# EAGLE design gt-jtx (EAGLE 6.3)
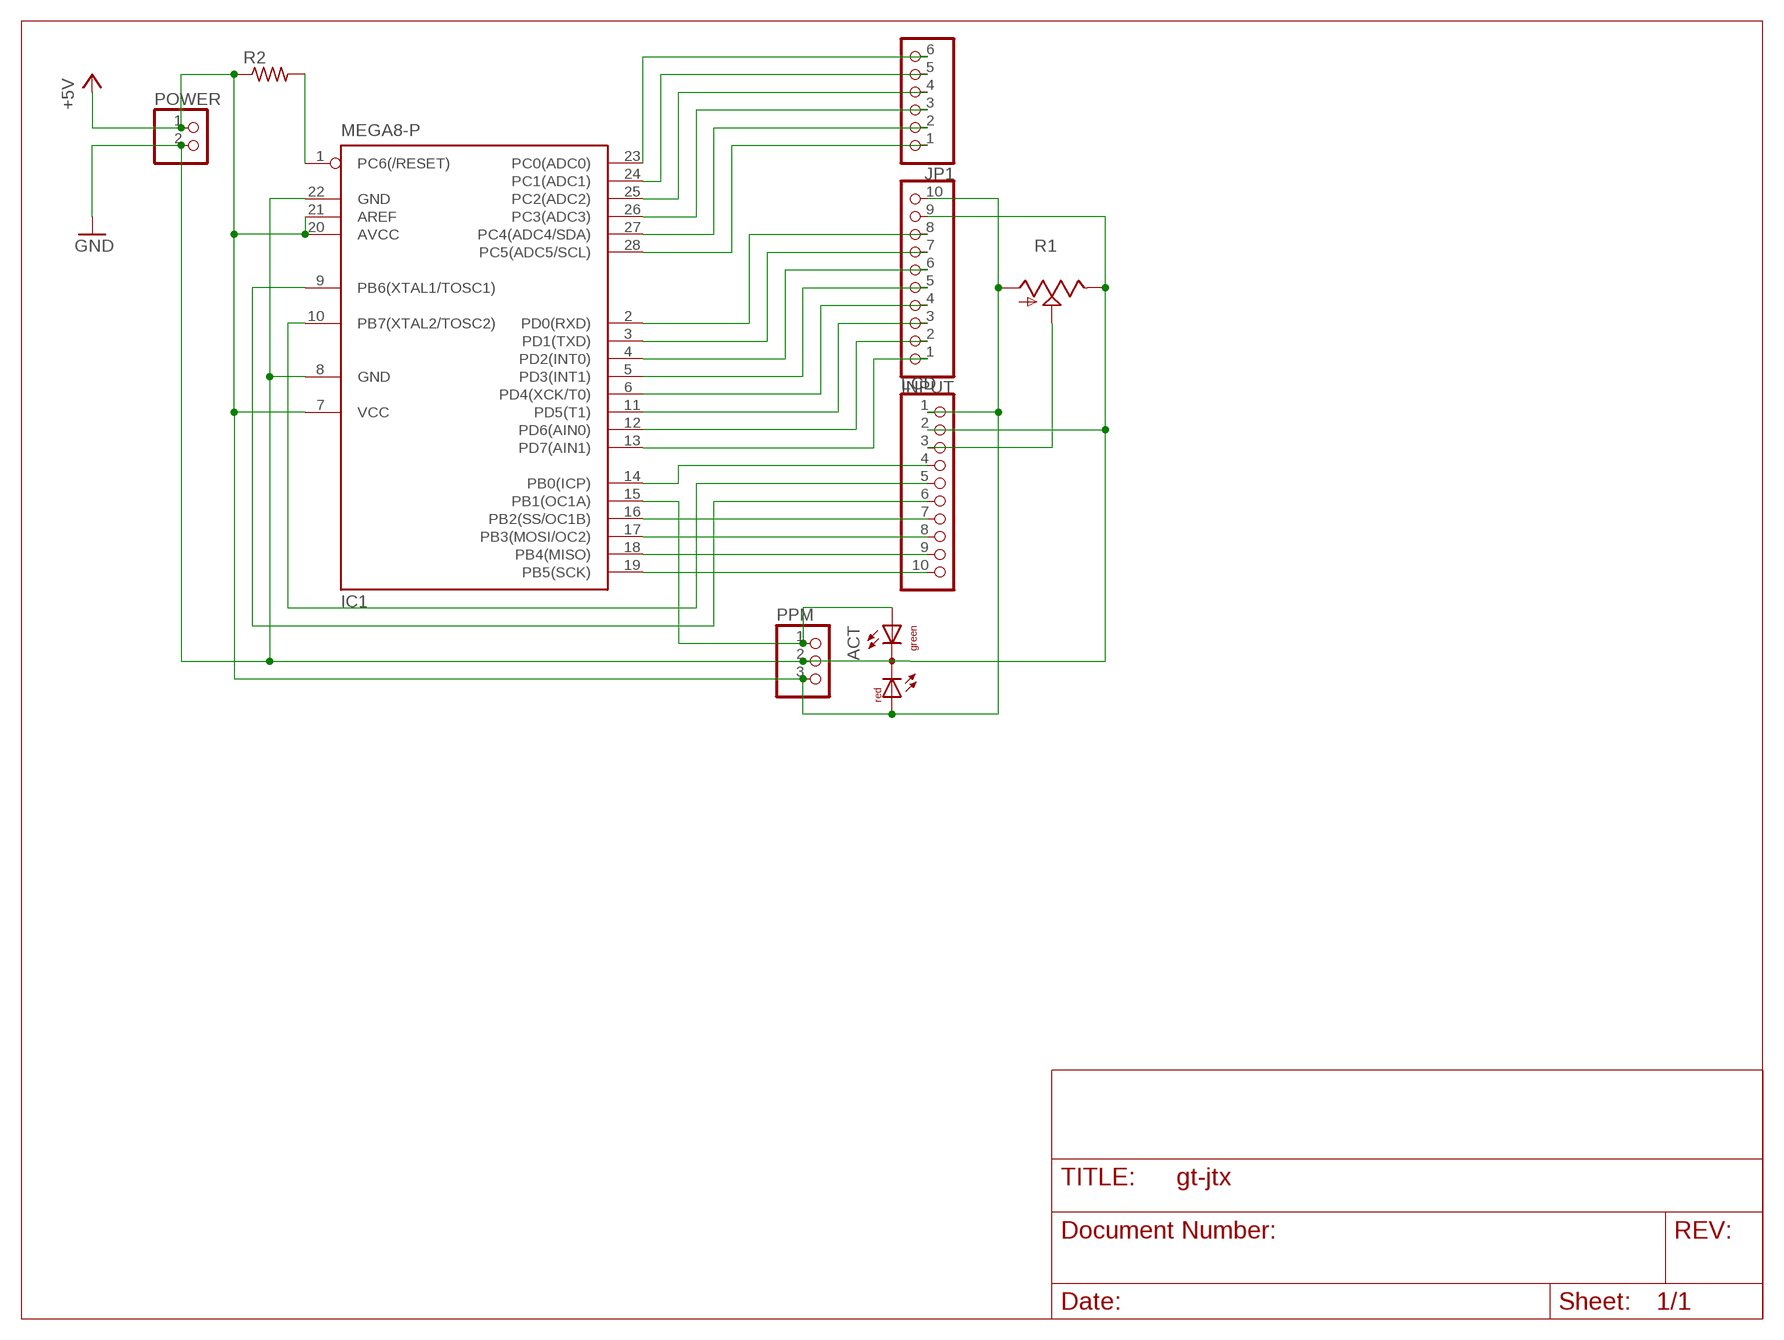
[diagram p0: schematic, sheet 1]

## Parts
ACT  DUOLED-RG-C  [DUOLED-C-5MM]
IC1  MEGA8-P  [DIL28-3]
INPUT  PINHD-1X10  [1X10]
JP1  PINHD-1X6  [1X06]
LCD  PINHD-1X10  [1X10]
POWER  PINHD-1X2  [1X02]
PPM  PINHD-1X3  [1X03]
R1  TRIM_US-CA6V  [CA6V]
R2  R-US_0204/2V  [0204V]

## Nets
+5V: ACT.AR IC1.7(VCC) IC1.20(AVCC) IC1.21(AREF) INPUT.10 LCD.1 POWER.1 PPM.3 R1.A R2.1
GND: ACT.C IC1.8(GND) IC1.22(GND) INPUT.9 LCD.2 POWER.2 PPM.2 R1.E
N$1: IC1.23(PC0(ADC0)) JP1.6
N$2: IC1.24(PC1(ADC1)) JP1.5
N$3: IC1.25(PC2(ADC2)) JP1.4
N$4: IC1.26(PC3(ADC3)) JP1.3
N$5: IC1.14(PB0(ICP)) LCD.4
N$6: IC1.10(PB7(XTAL2/TOSC2)) LCD.5
N$7: IC1.9(PB6(XTAL1/TOSC1)) LCD.6
N$8: IC1.2(PD0(RXD)) INPUT.8
N$9: LCD.3 R1.S
N$10: IC1.27(PC4(ADC4/SDA)) JP1.2
N$11: IC1.28(PC5(ADC5/SCL)) JP1.1
N$12: IC1.19(PB5(SCK)) LCD.10
N$13: IC1.18(PB4(MISO)) LCD.9
N$14: IC1.17(PB3(MOSI/OC2)) LCD.8
N$15: IC1.16(PB2(SS/OC1B)) LCD.7
N$16: ACT.AX(AG) IC1.15(PB1(OC1A)) PPM.1
N$17: IC1.3(PD1(TXD)) INPUT.7
N$18: IC1.4(PD2(INT0)) INPUT.6
N$19: IC1.5(PD3(INT1)) INPUT.5
N$20: IC1.6(PD4(XCK/T0)) INPUT.4
N$21: IC1.11(PD5(T1)) INPUT.3
N$22: IC1.13(PD7(AIN1)) INPUT.1
N$23: IC1.12(PD6(AIN0)) INPUT.2
N$25: IC1.1(PC6(/RESET)) R2.2

## Library data of the parts
ACT = led:DUOLED-RG-C: DUO LED 2 colors (red/green), 5 mm, round, common Cathode www.ligitek.com or other producers.
IC1 = atmel:MEGA8-P: MICROCONTROLLER 8 Kbytes FLASH, 1 kbytes SRAM, 512 bytes EEPROM, USART, 4-channel 10 bit ADC, 2-channel 8 bit ADC Pin compatible with Atmega48, ATMega88, ATMega168 Source: avr.lbr; OC_FARNELL: unknown; OC_NEWARK: unknown
INPUT LCD = pinhead:PINHD-1X10: PIN HEADER
JP1 = pinhead:PINHD-1X6: PIN HEADER
POWER = pinhead:PINHD-1X2: PIN HEADER
PPM = pinhead:PINHD-1X3: PIN HEADER
R1 = pot:TRIM_US-: POTENTIOMETER
R2 = resistor:R-US_: RESISTOR, American symbol

## Board
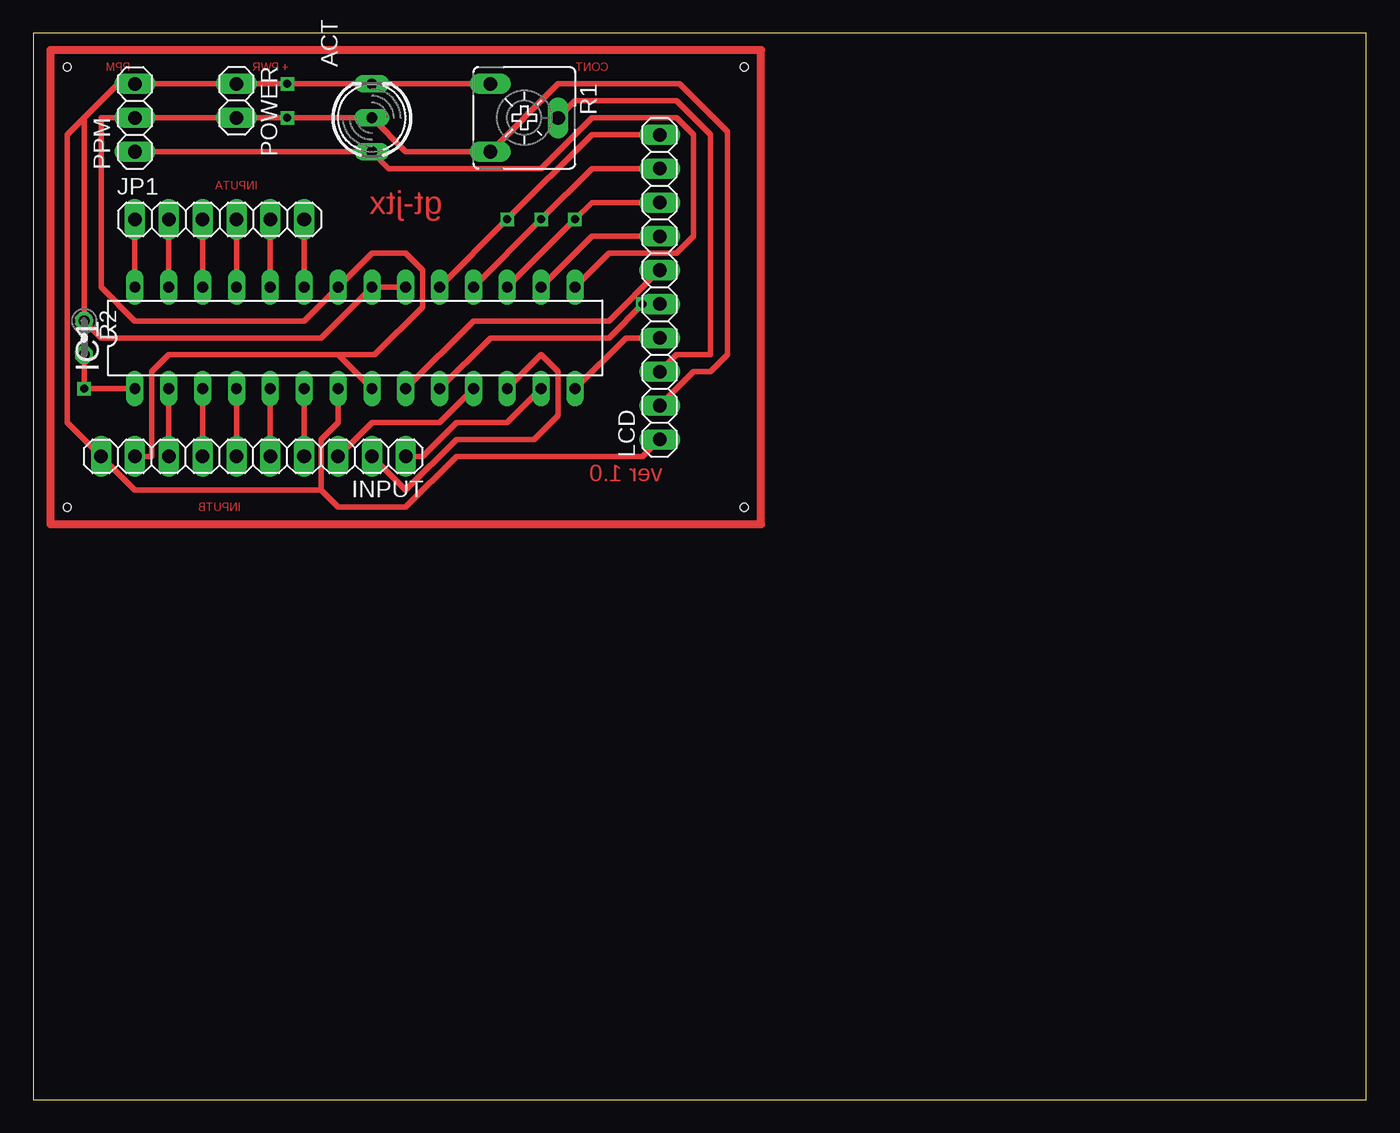
[diagram p1: board, top side]
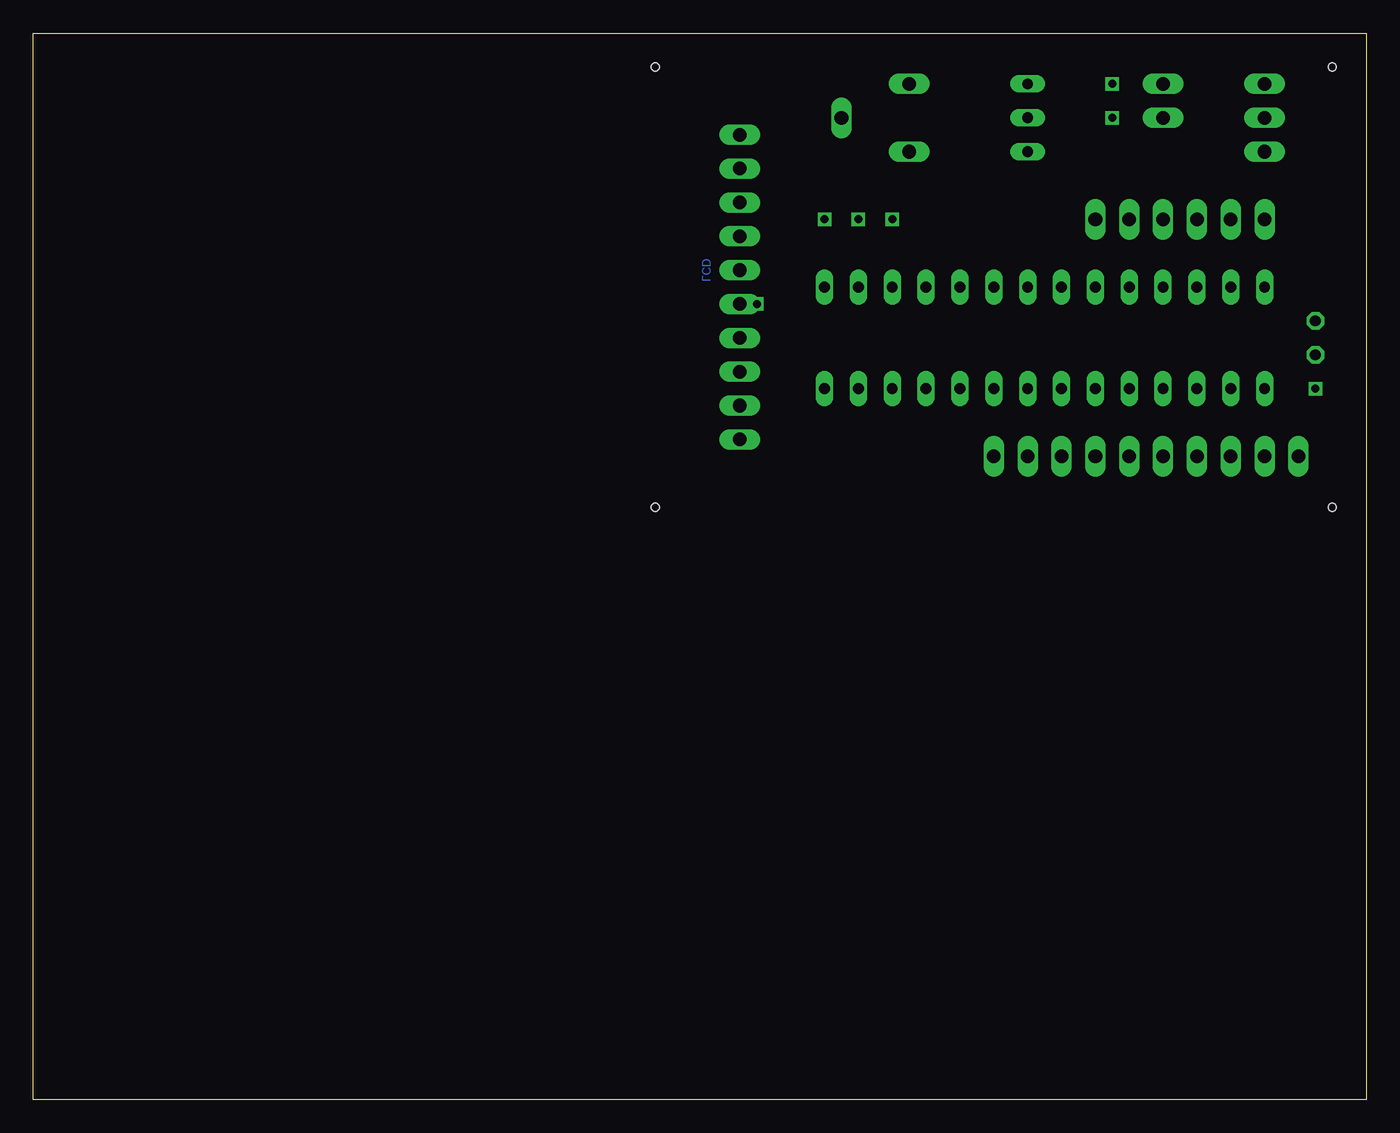
[diagram p2: board, bottom side, seen from below]

Size 100 x 80 mm. Coordinates in mm from the lower left corner, seen from the top.
Outline: 0,0 100,0 100,80 0,80 0,0
Copper layers (1*16): Top 0.035mm / dielectric 1.5mm / Bottom 0.035mm
Design rules "default": minimum track width 10mil, minimum drill 24mil, track to track 8mil, track to pad 8mil, pad to pad 8mil, via to via 8mil, smd to smd 8mil, copper to edge 40mil, drill to drill 8mil, minimum pad ring 10mil, minimum via ring 8mil, stop-mask expansion 4mil, vias tented up to drill 0mil, thermal gap 10mil
Holes 0.6 mm at 2.54,77.47 2.54,44.45 53.34,44.45 53.34,77.47

### Footprints (pad centres in the part's own frame; a part is rotated, then mirrored left to right if it is on the bottom)
DUOLED-C-5MM = drill 0.813 long: AR 2.54,0; AX -2.54,0; C 0,0
DIL28-3 = drill 0.813 long: 1 -16.51,-3.81; 2 -13.97,-3.81; 3 -11.43,-3.81; 4 -8.89,-3.81; 5 -6.35,-3.81; 6 -3.81,-3.81; 7 -1.27,-3.81; 8 1.27,-3.81; 9 3.81,-3.81; 10 6.35,-3.81; 11 8.89,-3.81; 12 11.43,-3.81; 13 13.97,-3.81; 14 16.51,-3.81; 15 16.51,3.81; 16 13.97,3.81; 17 11.43,3.81; 18 8.89,3.81; 19 6.35,3.81; 20 3.81,3.81; 21 1.27,3.81; 22 -1.27,3.81; 23 -3.81,3.81; 24 -6.35,3.81; 25 -8.89,3.81; 26 -11.43,3.81; 27 -13.97,3.81; 28 -16.51,3.81
1X10 = drill 1.016 long: 1 -11.43,0; 2 -8.89,0; 3 -6.35,0; 4 -3.81,0; 5 -1.27,0; 6 1.27,0; 7 3.81,0; 8 6.35,0; 9 8.89,0; 10 11.43,0
1X06 = drill 1.016 long: 1 -6.35,0; 2 -3.81,0; 3 -1.27,0; 4 1.27,0; 5 3.81,0; 6 6.35,0
1X02 = drill 1.016 long: 1 -1.27,0; 2 1.27,0
1X03 = drill 1.016 long: 1 -2.54,0; 2 0,0; 3 2.54,0
CA6V = drill 1.016 long: A -2.54,-2.54; E 2.54,-2.54; S 0,2.54
0204V = drill 0.813 octagon: 1 -1.27,0; 2 1.27,0

### Placement (x,y rotation side)
ACT  25.4,73.66 90 top
IC1  24.13,57.15 0 top
INPUT  16.51,48.26 180 top
JP1  13.97,66.04 0 top
LCD  46.99,60.96 90 top
POWER  15.24,74.93 270 top
PPM  7.62,73.66 90 top
R1  36.83,73.66 270 top
R2  3.81,57.15 270 top

### Tracks (layer width: path | path; a pad name or v marks a point on that pad's centre or on a via)
+5V  (via drill 0.6)
  Top 0.406: R1.A ACT.AR v19.05,76.2 POWER.1 PPM.3 6.35,76.2 3.81,73.66 | IC1.20 IC1.21 21.59,57.15 5.08,57.15 R2.1 3.81,73.66 | IC1.7 22.86,50.8 21.59,49.53 21.59,45.72 | 21.59,45.72 7.62,45.72 INPUT.10 2.54,50.8 2.54,72.39 3.81,73.66 | LCD.1 45.72,48.26 31.75,48.26 27.94,44.45 22.86,44.45 21.59,45.72
GND  (via drill 0.6)
  Top 0.406: 22.86,55.88 IC1.8 | 22.86,55.88 10.16,55.88 8.89,54.61 8.89,48.26 INPUT.9 | 22.86,55.88 25.62,55.88 29.21,59.47 29.21,62.23 27.94,63.5 25.4,63.5 IC1.22 20.32,58.42 7.62,58.42 5.08,60.96 5.08,73.66 PPM.2 POWER.2 v19.05,73.66 ACT.C 27.94,71.12 R1.E 39.37,76.2 48.48,76.2 52.07,72.61 52.07,55.88 50.8,54.61 49.53,54.61 LCD.2
N$1
  Top 0.406: JP1.6 IC1.23
N$2
  Top 0.406: JP1.5 IC1.24
N$3
  Top 0.406: JP1.4 IC1.25
N$4
  Top 0.406: JP1.3 IC1.26
N$5
  Top 0.406: IC1.14 44.45,57.15 LCD.4
N$6  (via drill 0.6)
  Top 0.406: IC1.10 34.29,57.15 43.18,57.15 v45.72,59.69
  Bottom 0.254: LCD.5 v45.72,59.69
N$7
  Top 0.406: IC1.9 33.02,58.42 43.18,58.42 LCD.6
N$8
  Top 0.406: INPUT.8 IC1.2
N$9
  Top 0.406: R1.S 40.64,74.93 48.26,74.93 50.8,72.39 50.8,55.88 48.26,55.88 LCD.3
N$10
  Top 0.406: JP1.2 IC1.27
N$11
  Top 0.406: JP1.1 IC1.28
N$12  (via drill 0.6)
  Top 0.406: IC1.19 v35.56,66.04 41.91,72.39 LCD.10
N$13  (via drill 0.6)
  Top 0.406: IC1.18 v38.1,66.04 41.91,69.85 LCD.9
N$14  (via drill 0.6)
  Top 0.406: IC1.17 v40.64,66.04 41.91,67.31 LCD.8
N$15
  Top 0.406: IC1.16 41.91,64.77 LCD.7
N$16
  Top 0.406: IC1.15 43.18,63.5 48.26,63.5 49.53,64.77 49.53,72.39 48.26,73.66 41.91,73.66 38.1,69.85 26.67,69.85 ACT.AX PPM.1
N$17
  Top 0.406: INPUT.7 IC1.3
N$18
  Top 0.406: INPUT.6 IC1.4
N$19
  Top 0.406: INPUT.5 IC1.5
N$20
  Top 0.406: INPUT.4 IC1.6
N$21
  Top 0.406: IC1.11 30.48,50.8 25.4,50.8 INPUT.3
N$22
  Top 0.406: IC1.13 35.56,50.8 31.75,50.8 29.21,48.26 INPUT.1
N$23
  Top 0.406: IC1.12 38.1,55.88 39.37,54.61 39.37,51.33 37.57,49.53 31.75,49.53 27.94,45.72 INPUT.2
N$24
  Top 0.61: 1.27,78.74 1.27,43.18 54.61,43.18 54.61,78.74 1.27,78.74
N$25  (via drill 0.6)
  Top 0.406: IC1.1 v3.81,53.34 R2.2

### Text on the board
Top: PPM | + PWR | CONT | INPUTA | gt-jtx | ver 1.0 | INPUTB
Bottom: LCD